# EAGLE design cellpilot (EAGLE 7.2.0)
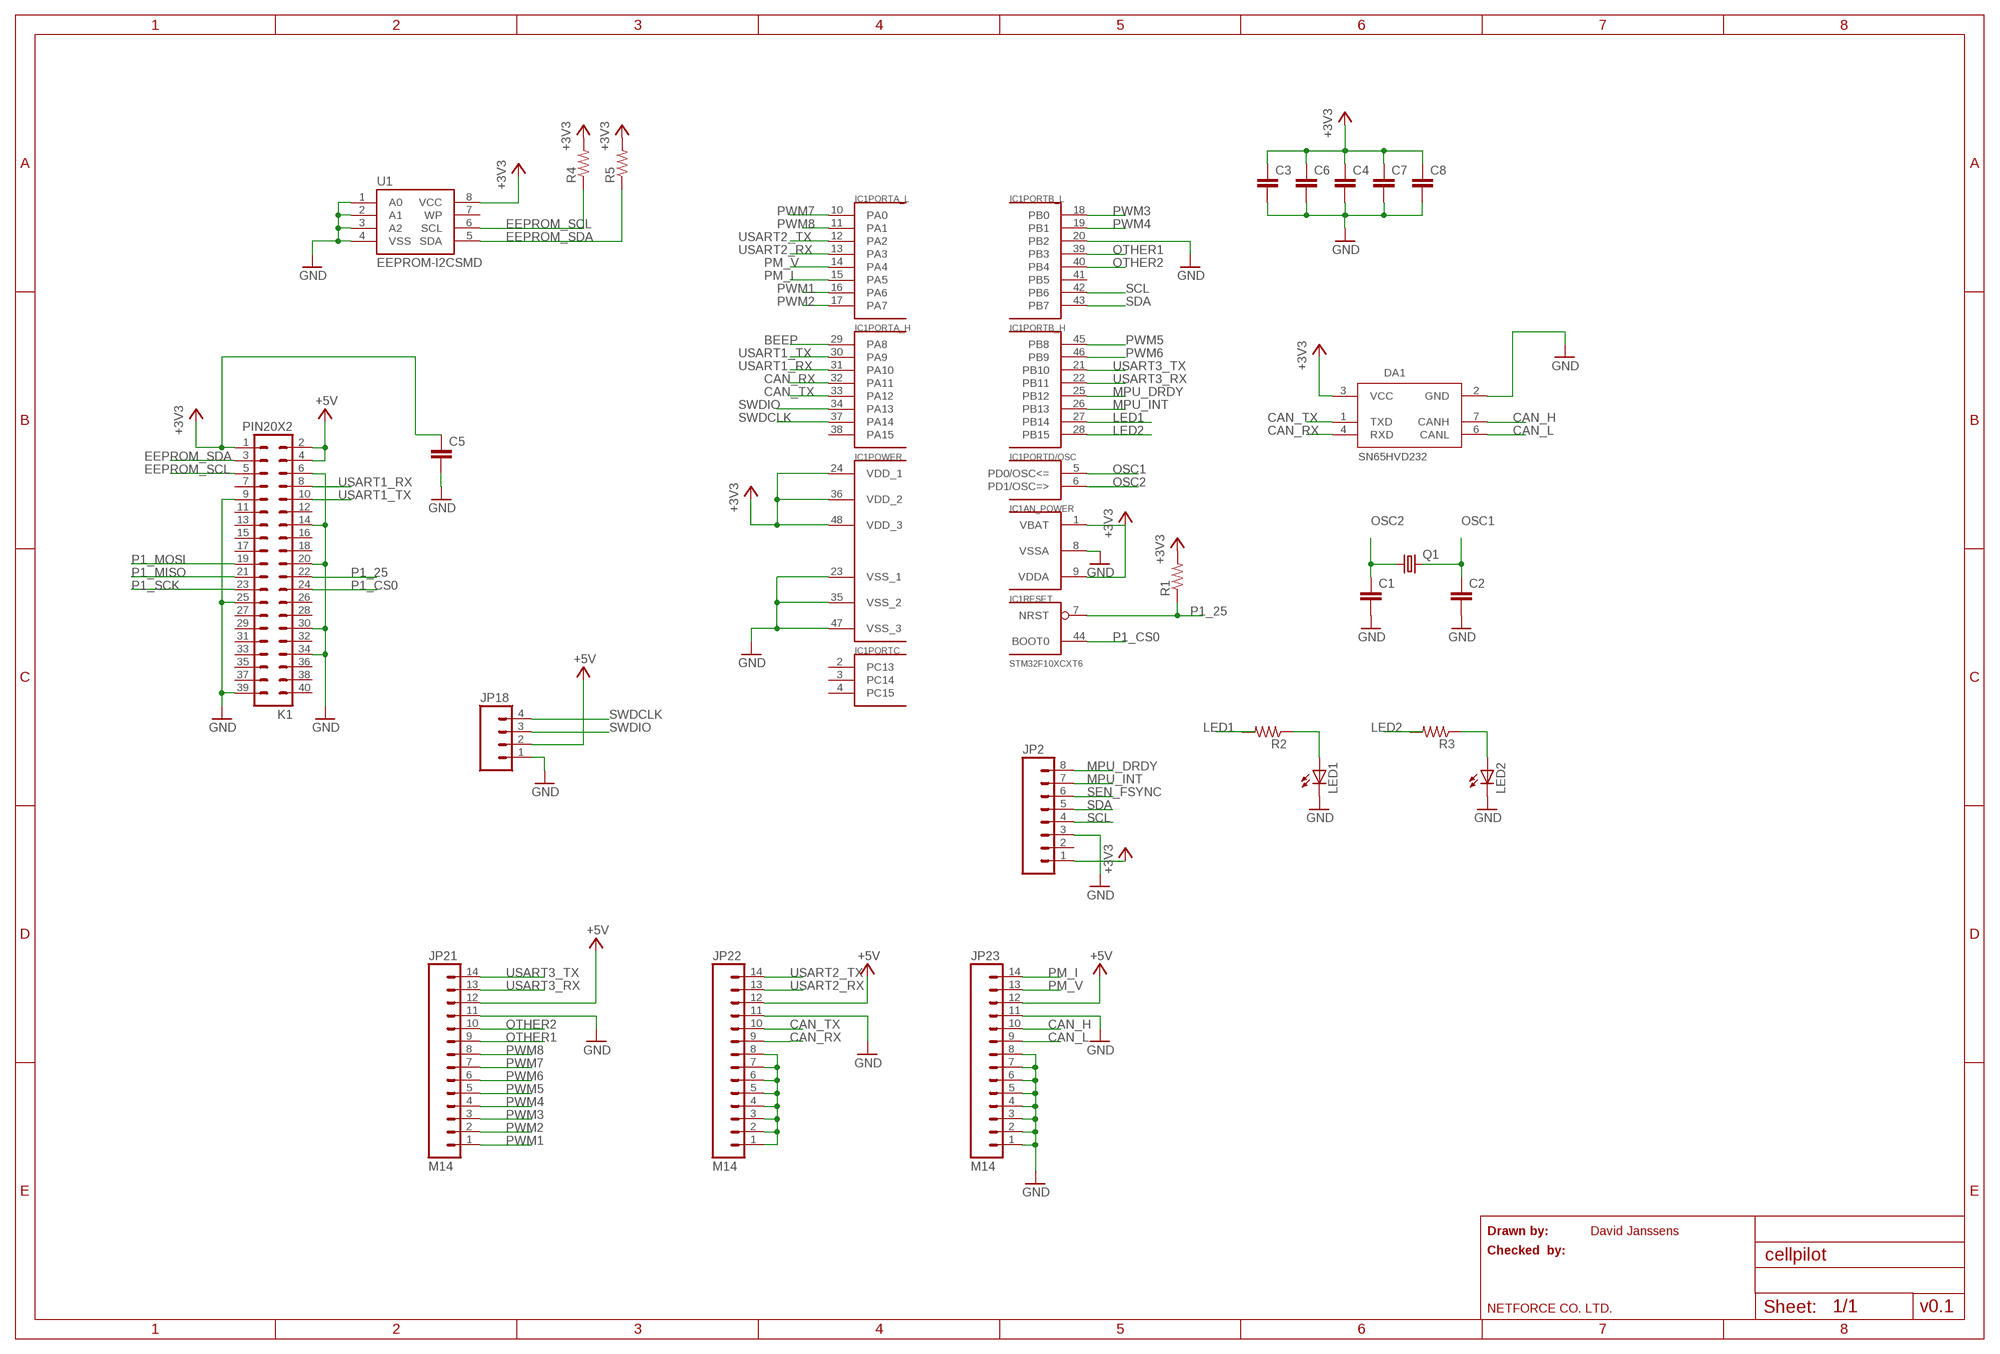
[diagram p0: schematic, sheet 1]

## Parts
C1  CAP0805  [0805]
C2  CAP0805  [0805]
C3  CAP0805  [0805]
C4  CAP0805  [0805]
C5  CAP0805  [0805]
C6  CAP0805  [0805]
C7  CAP0805  [0805]
C8  CAP0805  [0805]
DA1  SN65HVD232  [SO08]
IC1  STM32F10XCXT6  [TQFP48]
JP2  M08  [1X08_ROUND]
JP18  M04PTH  [1X04]
JP21  M14  [1X14]
JP22  M14  [1X14]
JP23  M14  [1X14]
K1  PIN20X2  [PIN_20X2]
LED1  LED3MM  [LED3MM]
LED2  LED3MM  [LED3MM]
Q1  CRYSTALHC49S  [HC49/S]
R1  RESISTOR0805-RES  [0805]
R2  RESISTOR0805-RES  [0805]
R3  RESISTOR0805-RES  [0805]
R4  RESISTOR0805-RES  [0805]
R5  RESISTOR0805-RES  [0805]
U1  EEPROM-I2CSMD  [SO08]

## Nets
+3V3: C3.1 C4.1 C5.1 C6.1 C7.1 C8.1 DA1.3(VCC) IC1.1(AN_POWER:VBAT) IC1.9(AN_POWER:VDDA) IC1.24(POWER:VDD_1) IC1.36(POWER:VDD_2) IC1.48(POWER:VDD_3) JP2.1 K1.1 R1.2 R4.2 R5.2 U1.8(VCC)
+5V: JP18.2 JP21.12 JP22.12 JP23.12 K1.2 K1.4
BEEP: IC1.29(PORTA_H:PA8)
CAN_H: DA1.7(CANH) JP23.10
CAN_L: DA1.6(CANL) JP23.9
CAN_RX: DA1.4(RXD) IC1.32(PORTA_H:PA11) JP22.9
CAN_TX: DA1.1(TXD) IC1.33(PORTA_H:PA12) JP22.10
EEPROM_SCL: K1.5 R4.1 U1.6(SCL)
EEPROM_SDA: K1.3 R5.1 U1.5(SDA)
GND: C1.2 C2.2 C3.2 C4.2 C5.2 C6.2 C7.2 C8.2 DA1.2(GND) IC1.8(AN_POWER:VSSA) IC1.20(PORTB_L:PB2) IC1.23(POWER:VSS_1) IC1.35(POWER:VSS_2) IC1.47(POWER:VSS_3) JP2.3 JP18.1 JP21.11 JP22.11 JP23.1 JP23.2 JP23.3 JP23.4 JP23.5 JP23.6 JP23.7 JP23.8 JP23.11 K1.6 K1.9 K1.14 K1.20 K1.25 K1.30 K1.34 K1.39 LED1.K(C) LED2.K(C) U1.1(A0) U1.2(A1) U1.3(A2) U1.4(VSS)
LED1: IC1.27(PORTB_H:PB14) R2.2
LED2: IC1.28(PORTB_H:PB15) R3.2
MPU_DRDY: IC1.25(PORTB_H:PB12) JP2.8
MPU_INT: IC1.26(PORTB_H:PB13) JP2.7
N$1: LED1.A R2.1
N$3: JP22.1 JP22.2 JP22.3 JP22.4 JP22.5 JP22.6 JP22.7 JP22.8
N$5: LED2.A R3.1
OSC1: C2.1 IC1.5(PORTD/OSC:PD0/OSC<=) Q1.2
OSC2: C1.1 IC1.6(PORTD/OSC:PD1/OSC=>) Q1.1
OTHER1: IC1.39(PORTB_L:PB3) JP21.9
OTHER2: IC1.40(PORTB_L:PB4) JP21.10
P1_25: IC1.7(RESET:NRST) K1.22 R1.1
P1_CS0: IC1.44(RESET:BOOT0) K1.24
P1_MISO: K1.21
P1_MOSI: K1.19
P1_SCK: K1.23
PM_I: IC1.15(PORTA_L:PA5) JP23.14
PM_V: IC1.14(PORTA_L:PA4) JP23.13
PWM1: IC1.16(PORTA_L:PA6) JP21.1
PWM2: IC1.17(PORTA_L:PA7) JP21.2
PWM3: IC1.18(PORTB_L:PB0) JP21.3
PWM4: IC1.19(PORTB_L:PB1) JP21.4
PWM5: IC1.45(PORTB_H:PB8) JP21.5
PWM6: IC1.46(PORTB_H:PB9) JP21.6
PWM7: IC1.10(PORTA_L:PA0) JP21.7
PWM8: IC1.11(PORTA_L:PA1) JP21.8
SCL: IC1.42(PORTB_L:PB6) JP2.4
SDA: IC1.43(PORTB_L:PB7) JP2.5
SEN_FSYNC: JP2.6
SWDCLK: IC1.37(PORTA_H:PA14) JP18.4
SWDIO: IC1.34(PORTA_H:PA13) JP18.3
USART1_RX: IC1.31(PORTA_H:PA10) K1.8
USART1_TX: IC1.30(PORTA_H:PA9) K1.10
USART2_RX: IC1.13(PORTA_L:PA3) JP22.13
USART2_TX: IC1.12(PORTA_L:PA2) JP22.14
USART3_RX: IC1.22(PORTB_H:PB11) JP21.13
USART3_TX: IC1.21(PORTB_H:PB10) JP21.14
Unconnected: IC1.2(PORTC:PC13) IC1.3(PORTC:PC14) IC1.4(PORTC:PC15) IC1.38(PORTA_H:PA15) IC1.41(PORTB_L:PB5) JP2.2 K1.7 K1.11 K1.12 K1.13 K1.15 K1.16 K1.17 K1.18 K1.26 K1.27 K1.28 K1.29 K1.31 K1.32 K1.33 K1.35 K1.36 K1.37 K1.38 K1.40 U1.7(WP)

## Notes on the sheet
- Drawn by: | David Janssens
- Checked  by:
- NETFORCE CO. LTD. | v0.1

## Library data of the parts
C1-C8 = SparkFun-Passives:CAP: Capacitor Standard 0603 ceramic capacitor, and 0.1" leaded capacitor.
DA1 = transceiver:SN65HVD232: CAN TRANSCEIVER
IC1 = stm32:STM32F10XCXT6: ST STM32F101/103 48pin LQFP
JP2 = SparkFun-Connectors:M08: Header 8 Standard 8-pin 0.1" header. Use with straight break away headers (SKU : PRT-00116), right angle break away headers (PRT-00553), swiss pins (PRT-00743), machine pins (PRT-00117), and female headers (PRT-00115).
JP18 = SparkFun-Connectors:M04: Header 4 Standard 4-pin 0.1" header. Use with straight break away headers (SKU : PRT-00116), right angle break away headers (PRT-00553), swiss pins (PRT-00743), machine pins (PRT-00117), and female headers (PRT-00115). Molex polarized connector foot print use with SKU : PRT-08231 with associated crimp pins and housings. 1MM SMD Version SKU: PRT-10208
JP21-JP23 = SparkFun-Connectors:M14: Header 14 Standard 14-pin 0.1" header. Use with straight break away headers (SKU : PRT-00116), right angle break away headers (PRT-00553), swiss pins (PRT-00743), machine pins (PRT-00117), and female headers (PRT-00115).
K1 = FLYFISH:PIN20X2
LED1 LED2 = adafruit:LED: LED OSRAM: - CHIPLED LG R971, LG N971, LY N971, LG Q971, LY Q971, LO R971, LY R971 LH N974, LH R974 LS Q976, LO Q976, LY Q976 LO Q996 - Hyper CHIPLED LW Q18S LB Q993, LB Q99A, LB R99A - SideLED LS A670, LO A670, LY A670, LG A670, LP A670 LB A673, LV A673, LT A673, LW A673 LH A674 LY A675 LS A676, LA A676, LO A676, LY A676, LW A676 LS A679, LY A679, LG A679 - Hyper Micro SIDELED® LS Y876, LA Y876, LO Y876, LY Y876 LT Y87S - SmartLED LW L88C, LW L88S LB L89C, LB L89S, LG L890 LS L89K, LO L89K, LY L89K LS L896, LA L896, LO L896, LY L896 - TOPLED LS T670, LO T670, LY T670, LG T670, LP T670 LSG T670, LSP T670, LSY T670, LOP T670, LYG T670 LG T671, LOG T671, LSG T671 LB T673, LV T673, LT T673, LW T673 LH T674 LS T676, LA T676, LO T676, LY T676, LB T676, LH T676, LSB T676, LW T676 LB T67C, LV T67C, LT T67C, LS T67K, LO T67K, LY T67K, LW E67C LS E67B, LA E67B, LO E67B, LY E67B, LB E67C, LV E67C, LT E67C LW T67C LS T679, LY T679, LG T679 LS T770, LO T770, LY T770, LG T770, LP T770 LB T773, LV T773, LT T773, LW T773 LH T774 LS E675, LA E675, LY E675, LS T675 LS T776, LA T776, LO T776, LY T776, LB T776 LHGB T686 LT T68C, LB T68C - Hyper Mini TOPLED® LB M676 - Mini TOPLED Santana® LG M470 LS M47K, LO M47K, LY M47K Source: http://www.osram.convergy.de/
Q1 = adafruit:CRYSTAL: CRYSTAL; OC_FARNELL: 1667008; OC_NEWARK: unknown
R1-R5 = SparkFun-Passives:RESISTOR: Resistor Basic schematic elements and footprints for 0603, 1206, and PTH resistors.
U1 = SparkFun-DigitalIC:EEPROM-I2C: I2C EEPROM chips, 24LC256 (and others)

## Board
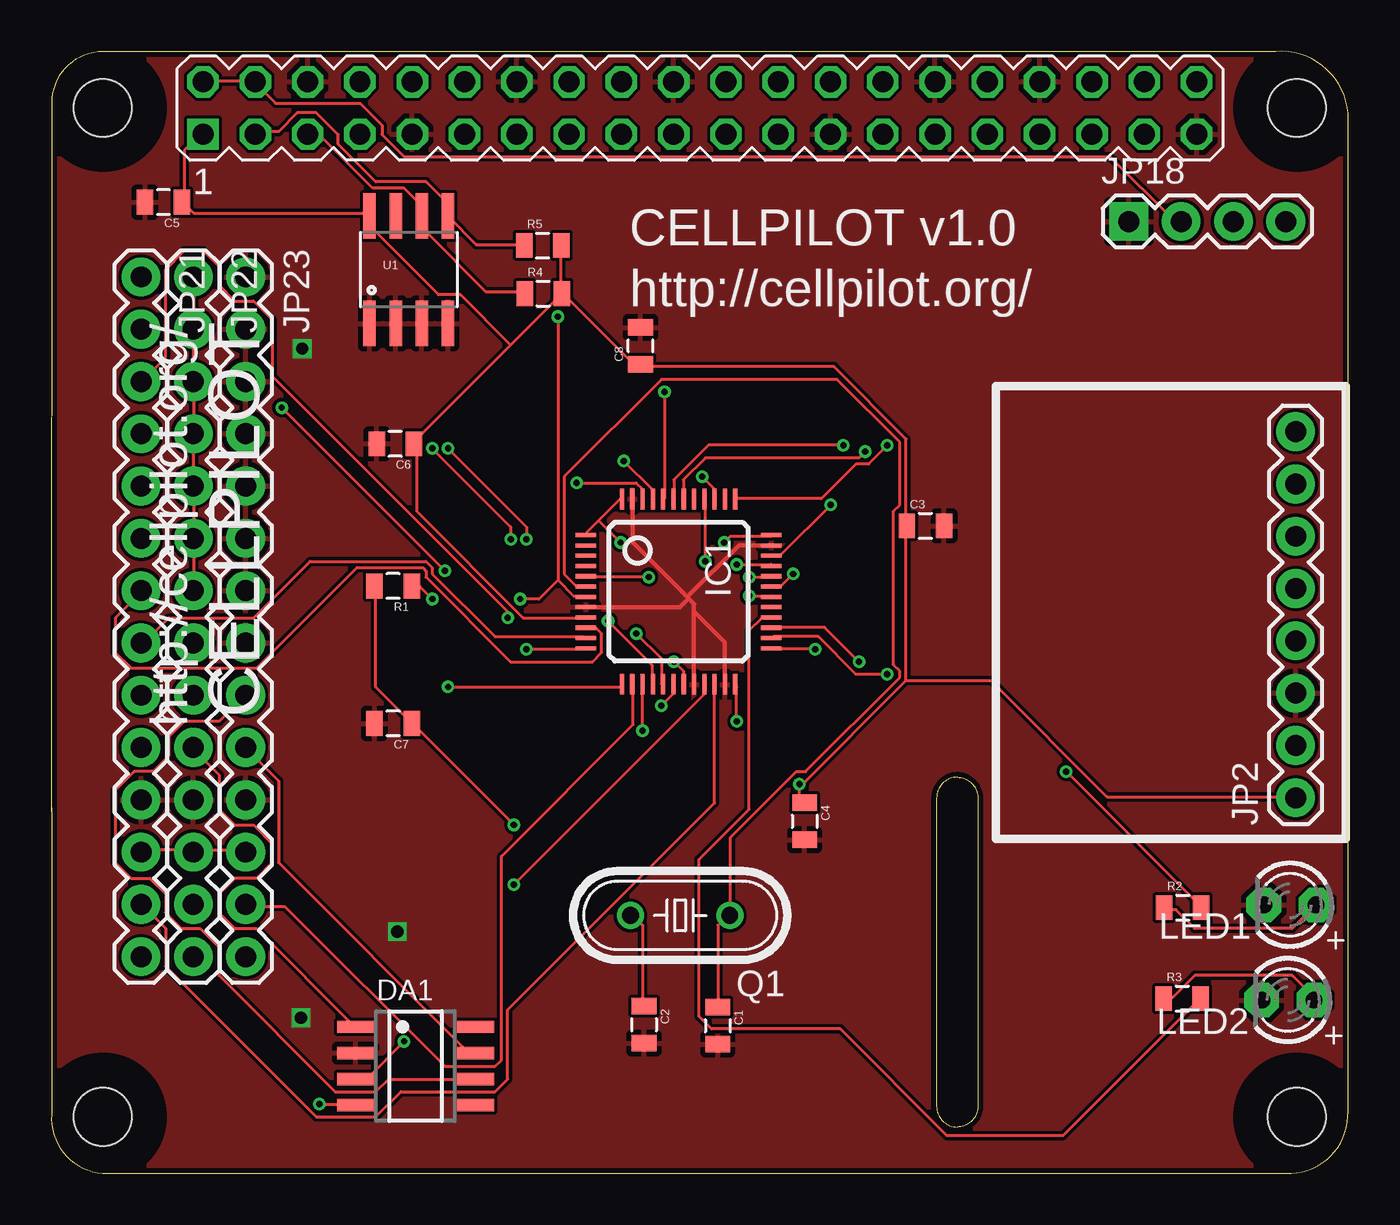
[diagram p1: board, top side]
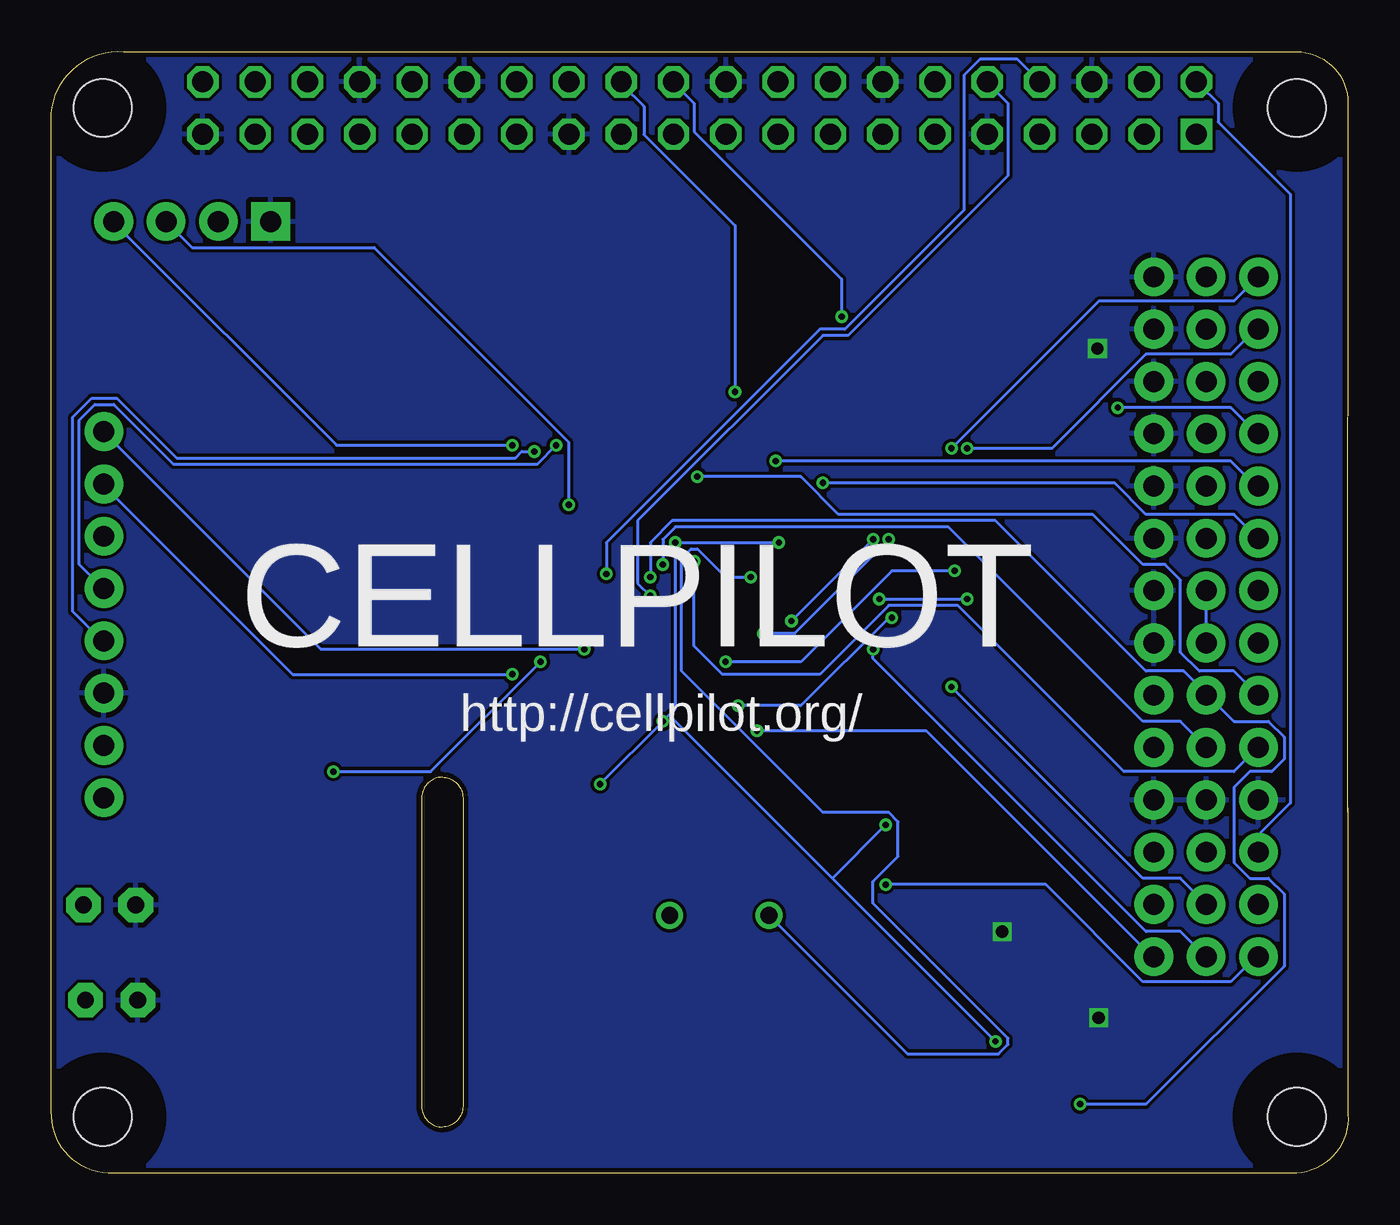
[diagram p2: board, bottom side, seen from below]

Size 62.97 x 54.49 mm. Coordinates in mm from the lower left corner, seen from the top.
Outline: 0.01,51.98 arc-90 2.5,54.48 59.47,54.48 arc-90 62.97,51.48 62.97,3 arc-90 60.23,0 2.5,0 arc-90 0.01,2.87 0.01,17.55
Outline: 0.01,17.74 0.01,17.55
Outline: 0.01,52.03 0.01,36.78
Outline: 0.01,17.55 0.01,36.73
Outline: 42.99,18.24 42.99,3.24 arc90 43.99,2.24 arc90 44.99,3.24 44.99,18.24 arc90 43.99,19.24 arc90 42.99,18.24
Copper layers (1*16): Top 0.035mm / dielectric 1.5mm / Bottom 0.035mm
Design rules "ITEADstudio_DRC": minimum track width 6mil, minimum drill 12mil, track to track 6mil, track to pad 6mil, pad to pad 6mil, via to via 6mil, smd to smd 0mil, copper to edge 10mil, drill to drill 10mil, minimum pad ring 10mil, minimum via ring 6mil, stop-mask expansion 2mil, vias tented up to drill 100mil, thermal gap 10mil
Holes 2.8 mm at 2.49,2.74 2.49,51.74 60.49,51.74 60.49,2.74
tRestrict: area 0.9,50.2 to 4,53.3; area 58.9,50.2 to 62,53.3; area 58.9,1.2 to 62,4.3; area 0.9,1.2 to 4,4.3
bRestrict: area 0.9,1.2 to 4,4.3; area 0.9,50.2 to 4,53.3; area 58.9,1.2 to 62,4.3; area 58.9,50.2 to 62,53.3
Milling: 6 lines

### Footprints (pad centres in the part's own frame; a part is rotated, then mirrored left to right if it is on the bottom)
0805 = smd 0.8 x 1.2: 1 -0.9,0; 2 0.9,0
SO08 = smd 0.6 x 1.8: 1 -1.905,-2.917; 2 -0.635,-2.917; 3 0.635,-2.917; 4 1.905,-2.917; 5 1.905,2.917; 6 0.635,2.917; 7 -0.635,2.917; 8 -1.905,2.917
TQFP48 = smd 0.2 x 1: 1 -2.75,-4.5; 2 -2.25,-4.5; 3 -1.75,-4.5; 4 -1.25,-4.5; 5 -0.75,-4.5; 6 -0.25,-4.5; 7 0.25,-4.5; 8 0.75,-4.5; 9 1.25,-4.5; 10 1.75,-4.5; 11 2.25,-4.5; 12 2.75,-4.5; 25 2.75,4.5; 26 2.25,4.5; 27 1.75,4.5; 28 1.25,4.5; 29 0.75,4.5; 30 0.25,4.5; 31 -0.25,4.5; 32 -0.75,4.5; 33 -1.25,4.5; 34 -1.75,4.5; 35 -2.25,4.5; 36 -2.75,4.5 | smd 1 x 0.2: 13 4.5,-2.75; 14 4.5,-2.25; 15 4.5,-1.75; 16 4.5,-1.25; 17 4.5,-0.75; 18 4.5,-0.25; 19 4.5,0.25; 20 4.5,0.75; 21 4.5,1.25; 22 4.5,1.75; 23 4.5,2.25; 24 4.5,2.75; 37 -4.5,2.75; 38 -4.5,2.25; 39 -4.5,1.75; 40 -4.5,1.25; 41 -4.5,0.75; 42 -4.5,0.25; 43 -4.5,-0.25; 44 -4.5,-0.75; 45 -4.5,-1.25; 46 -4.5,-1.75; 47 -4.5,-2.25; 48 -4.5,-2.75
1X08_ROUND = drill 1.016 pad 1.88: 1 0,0; 2 2.54,0; 3 5.08,0; 4 7.62,0; 5 10.16,0; 6 12.7,0; 7 15.24,0; 8 17.78,0
1X04 = drill 1.016 pad 1.88 square: 1 0,0 | drill 1.016 pad 1.88: 2 2.54,0; 3 5.08,0; 4 7.62,0
1X14 = drill 1.016 pad 1.88: 1 0,0; 2 2.54,0; 3 5.08,0; 4 7.62,0; 5 10.16,0; 6 12.7,0; 7 15.24,0; 8 17.78,0; 9 20.32,0; 10 22.86,0; 11 25.4,0; 12 27.94,0; 13 30.48,0; 14 33.02,0
PIN_20X2 = drill 1.016 square: 1 -24.13,-1.27 | drill 1.016 octagon: 2 -24.13,1.27; 3 -21.59,-1.27; 4 -21.59,1.27; 5 -19.05,-1.27; 6 -19.05,1.27; 7 -16.51,-1.27; 8 -16.51,1.27; 9 -13.97,-1.27; 10 -13.97,1.27; 11 -11.43,-1.27; 12 -11.43,1.27; 13 -8.89,-1.27; 14 -8.89,1.27; 15 -6.35,-1.27; 16 -6.35,1.27; 17 -3.81,-1.27; 18 -3.81,1.27; 19 -1.27,-1.27; 20 -1.27,1.27; 21 1.27,-1.27; 22 1.27,1.27; 23 3.81,-1.27; 24 3.81,1.27; 25 6.35,-1.27; 26 6.35,1.27; 27 8.89,-1.27; 28 8.89,1.27; 29 11.43,-1.27; 30 11.43,1.27; 31 13.97,-1.27; 32 13.97,1.27; 33 16.51,-1.27; 34 16.51,1.27; 35 19.05,-1.27; 36 19.05,1.27; 37 21.59,-1.27; 38 21.59,1.27; 39 24.13,-1.27; 40 24.13,1.27
LED3MM = drill 0.813 pad 1.676 octagon: A -1.27,0; K 1.27,0
HC49/S = drill 0.813: 1 -2.413,0; 2 2.413,0
SO08' = smd 0.61 x 2.21: 1 -1.905,-2.616; 2 -0.635,-2.616; 3 0.635,-2.616; 4 1.905,-2.616; 5 1.905,2.616; 6 0.635,2.616; 7 -0.635,2.616; 8 -1.905,2.616

### Placement (x,y rotation side)
C1  32.37,7.16 270 top
C2  28.78,7.21 270 top
C3  42.45,31.45 0 top
C4  36.58,17.09 270 top
C5  5.44,47.17 180 top
C6  16.69,35.43 180 top
C7  16.59,21.84 180 top
C8  28.61,40.18 90 top
DA1  17.68,5.21 270 top
IC1  30.46,28.24 270 top
JP2  60.43,18.24 90 top
JP18  52.33,46.23 0 top
JP21  4.35,43.54 270 top
JP22  6.89,43.54 270 top
JP23  9.43,43.54 270 top
K1  31.49,51.74 0 top
LED1  60.15,13.03 180 top
LED2  60.05,8.41 180 top
Q1  30.54,12.52 180 top
R1  16.59,28.52 180 top
R2  54.95,12.9 0 top
R3  54.92,8.48 0 top
R4  23.88,42.72 0 top
R5  23.86,45.06 0 top
U1  EEPROM-I2CSMD  [SO08']  17.35,43.89 0 top

### Tracks (layer width: path | path; a pad name or v marks a point on that pad's centre or on a via)
+3V3  (via drill 0.3)
  Top 0.152: K1.1 7.22,50.44 6.46,49.68 6.46,47.24 C5.1 6.46,47.09 6.92,46.63 15.45,46.63 U1.8 15.45,46.48 15.45,46.02 18.8,42.67 19.87,42.67 22.31,40.23 | R5.2 24.75,44.96 24.75,42.82 R4.2 | R4.2 24.9,42.67 28.25,39.32 28.56,39.32 C8.1 28.71,39.17 38,39.17 41.51,35.66 41.51,31.55 C3.1 41.51,31.39 41.51,23.93 | IC1.9 25.81,26.97 22.92,26.97 17.74,32.16 17.74,35.36 C6.1 17.58,35.51 22.31,40.23 | 22.31,40.23 24.75,42.67 R4.2 | R1.2 15.75,28.5 15.75,23.62 17.43,21.95 C7.1 17.58,21.79 v22.46,16.92 | 26.57,31.7 27.64,32.77 IC1.48 | 26.57,31.7 25.97,31.09 IC1.1 | v33.28,21.95 33.28,23.62 IC1.24 | 36.33,18.75 36.33,18.29 36.48,18.14 C4.1 | 36.33,18.75 v36.33,18.9 36.33,18.75 | v32.67,30.63 32.98,30.94 34.96,30.94 IC1.36 | 36.33,18.75 41.51,23.93 | v17.13,6.4 15.3,4.57 14.84,4.57 DA1.3 | v27.64,30.63 26.57,31.7 | 41.51,23.93 45.62,23.93 51.26,18.29 60.41,18.29 JP2.1
  Bottom 0.152: v36.33,18.9 v33.28,21.95 32.98,22.25 | 32.98,22.25 32.67,22.55 v32.67,30.63 v27.64,30.63 | 32.98,22.25 25.05,14.33 | 25.05,14.33 v17.13,6.4 | 25.05,14.33 v22.46,16.92
+5V
  Top 0.152: JP21.12 4.48,15.7 6.76,15.7 JP22.12 6.92,15.7 9.35,15.7 JP23.12 | K1.2 7.37,53.03 9.81,53.03 K1.4 9.96,52.88 10.88,51.97 14.99,51.97 16.06,50.9 16.06,50.44 17.13,49.38 51.42,49.38 54.46,46.33 54.77,46.33 JP18.2
  Bottom 0.152: JP21.12 4.32,15.7 4.32,16.46 2.8,17.98 2.8,47.55 6.31,51.05 6.31,51.97 7.22,52.88 K1.2
CAN_H
  Top 0.152: DA1.7 20.48,5.94 20.17,5.94 11.03,15.09 11.03,19.05 9.51,20.57 JP23.10
CAN_L
  Top 0.152: DA1.6 20.48,4.57 16.36,4.57 15.75,3.96 13.77,3.96 8.13,9.6 8.13,10.97 7.22,11.89 6.31,11.89 5.54,12.65 5.54,13.56 4.78,14.33 3.87,14.33 3.11,15.09 3.11,18.59 4.02,19.51 4.93,19.51 5.7,20.27 5.7,21.18 6.46,21.95 8.13,21.95 9.35,23.16 JP23.9
CAN_RX  (via drill 0.3)
  Top 0.152: v33.89,28.96 34.96,28.96 IC1.32 | v13.01,3.35 14.69,3.35 DA1.4
  Bottom 0.152: v33.89,28.96 33.89,30.63 32.82,31.7 17.13,31.7 9.81,24.38 7.98,24.38 6.92,23.32 JP22.9 6.76,23.16 5.54,21.95 3.87,21.95 3.11,21.18 3.11,20.12 3.71,19.51 4.78,19.51 5.54,18.75 5.54,15.09 4.78,14.33 3.87,14.33 3.11,13.56 3.11,10.06 9.81,3.35 v13.01,3.35
CAN_TX  (via drill 0.3)
  Top 0.152: v33.28,29.57 34.96,29.57 IC1.33 | DA1.1 14.69,7.16 9.96,11.89 8.9,11.89 8.13,12.65 8.13,13.56 8.9,14.33 9.96,14.33 10.73,15.09 10.73,16 9.81,16.92 8.9,16.92 8.13,17.68 8.13,19.36 6.92,20.57 JP22.10
  Bottom 0.152: v33.28,29.57 33.28,30.79 32.67,31.39 19.41,31.39 9.96,21.95 8.13,21.95 6.92,20.73 JP22.10
EEPROM_SCL
  Top 0.152: R4.1 22.92,42.82 21.09,42.82 18.04,45.87 18.04,46.48 U1.6 17.89,46.63 17.89,47.09 17.13,47.85 15.6,47.85 13.01,50.44 12.55,50.44 K1.5
EEPROM_SDA
  Top 0.152: R5.1 22.92,45.11 20.63,45.11 19.26,46.48 U1.5 19.26,46.63 19.26,47.09 18.19,48.16 15.75,48.16 13.93,49.99 13.93,50.44 12.86,51.51 11.94,51.51 11.03,50.6 9.96,50.6 K1.3
GND  (via drill 0.6)
  Top 0.203: IC1.47 28.21,30.65 30.61,28.25 30.88,27.98 | IC1.20 31.21,27.28 | 31.21,27.28 31.21,27.65 30.94,27.91 | 30.94,27.91 30.88,27.98 | IC1.8 30.52,27.5 30.94,27.91 | IC1.23 32.71,25.78 31.21,27.28 | IC1.35 33.4,30.5 30.88,27.98
  other vias: 12.12,7.54 16.8,11.73 12.17,40.06
  pour Bottom: 0.01,2.36 arc90 3.26,0 59.97,0 arc90 62.97,3.25 62.97,51.22 arc90 59.97,54.48 3.01,54.48 arc90 0.01,51.22 0.01,17.74
  pour Top: 0.01,2.49 arc90 3.26,0 59.97,0 arc90 62.97,3.25 62.97,51.22 arc90 59.97,54.48 3.01,54.48 arc90 0.01,51.73 0.01,17.74
LED1  (via drill 0.3)
  Top 0.152: v39.22,24.84 37.55,26.52 35.11,26.52 IC1.27 | v49.28,19.51 55.84,12.95 R2.2
  Bottom 0.152: v39.22,24.84 44.56,19.51 v49.28,19.51
LED2
  Top 0.152: IC1.28 34.96,26.97 34.5,26.97 33.89,26.36 33.89,17.68 31.45,15.24 31.45,7.62 32.06,7.01 38.31,7.01 43.49,1.83 49.13,1.83 55.68,8.38 R3.2
MPU_DRDY  (via drill 0.3)
  Top 0.152: v37.09,25.45 35.11,25.45 IC1.25
  Bottom 0.152: v37.09,25.45 49.89,25.45 60.41,35.97 JP2.8
MPU_INT  (via drill 0.3)
  Top 0.152: v40.6,24.23 39.07,24.23 37.24,26.06 35.11,26.06 IC1.26
  Bottom 0.152: v40.6,24.23 51.26,24.23 60.41,33.38 JP2.7
N$1
  Top 0.152: R2.1 54.16,12.8 54.62,12.8 55.53,11.89 60.26,11.89 61.32,12.95 LED1.A
N$3
  Top 0.152: 6.92,41 6.92,43.43 JP22.1 | 6.92,41 JP22.2 6.92,41 | 6.92,33.38 6.92,30.94 JP22.6 6.92,30.79 6.92,28.35 JP22.7 | 6.92,33.38 JP22.5 6.92,33.38 | 6.92,33.38 6.92,35.81 JP22.4 6.92,35.97 6.92,38.41 JP22.3 6.92,38.56 6.92,41
  Bottom 0.152: JP22.8 6.92,25.76 6.92,28.19 JP22.7
N$5
  Top 0.152: R3.1 54.16,8.53 54.46,8.53 55.53,9.6 60.26,9.6 61.32,8.53 LED2.A
OSC1  (via drill 0.3)
  Top 0.152: v29.01,28.96 25.97,28.96 IC1.5 | C2.1 28.71,8.23 28.71,12.04 28.25,12.5 Q1.2
  Bottom 0.152: v29.01,28.96 30.23,28.96 31.6,30.33 31.91,30.33 32.37,29.87 32.37,24.38 25.51,17.53 22.31,17.53 21.85,17.07 21.85,15.39 23.07,14.17 23.07,13.11 16.52,6.55 16.52,6.25 16.97,5.79 21.39,5.79 28.1,12.5 Q1.2
OSC2
  Top 0.152: IC1.6 25.81,28.5 25.51,28.5 24.9,29.11 24.9,33.83 29.62,38.56 38.16,38.56 41.21,35.51 41.21,32.46 40.9,32.16 40.9,24.69 41.21,24.38 41.21,24.08 36.63,19.51 36.18,19.51 32.98,16.31 32.98,12.65 Q1.1 32.82,12.5 32.37,12.04 32.37,8.08 C1.1
OTHER1  (via drill 0.3)
  Top 0.152: v31.6,33.83 32.21,33.22 32.21,32.77 IC1.39
  Bottom 0.152: v31.6,33.83 26.57,33.83 24.75,32 12.4,32 9.96,29.57 8.9,29.57 8.13,28.8 8.13,25.3 7.22,24.38 5.54,24.38 4.48,23.32 JP21.9
OTHER2  (via drill 0.3)
  Top 0.152: v31.76,29.72 31.76,32.61 IC1.40
  Bottom 0.152: v31.76,29.72 31.76,25.6 30.38,24.23 25.66,24.23 22.31,27.58 18.95,27.58 10.88,19.51 5.54,19.51 4.48,20.57 JP21.10
P1_25  (via drill 0.3)
  Top 0.152: 24.59,28.8 25.36,28.04 25.81,28.04 IC1.7 | v24.59,41.6 24.59,28.8 | v18.5,27.89 17.89,28.5 17.58,28.5 R1.1 | v22.76,27.89 23.68,27.89 24.59,28.8
  Bottom 0.152: v24.59,41.6 24.59,43.43 31.76,50.6 31.76,51.97 32.67,52.88 K1.22 | v22.76,27.89 v18.5,27.89
P1_CS0  (via drill 0.3)
  Top 0.152: v29.78,37.95 29.78,32.77 IC1.44
  Bottom 0.152: v29.78,37.95 29.78,46.02 34.19,50.44 34.19,51.82 35.26,52.88 K1.24
PM_I  (via drill 0.3)
  Top 0.152: v28.71,21.49 28.71,23.62 IC1.15
  Bottom 0.152: v28.71,21.49 20.48,21.49 9.51,10.52 JP23.14
PM_V
  Top 0.152: IC1.14 28.25,23.62 28.25,21.79 21.85,15.39 21.85,5.49 21.55,5.18 19.11,5.18 11.33,12.95 9.51,12.95 JP23.13
PWM1  (via drill 0.3)
  Top 0.152: v27.03,26.82 29.17,24.69 29.17,23.77 IC1.16 | v23.07,30.79 23.07,31.39 v19.26,35.2
  Bottom 0.152: v23.07,30.79 v27.03,26.82 | v19.26,35.2 12.1,42.37 5.54,42.37 4.48,43.43 JP21.1
PWM2  (via drill 0.3)
  Top 0.152: v28.4,26.21 29.62,24.99 29.62,23.77 IC1.17 | v22.31,30.79 22.31,31.39 v18.5,35.2
  Bottom 0.152: v28.4,26.21 26.88,26.21 v22.31,30.79 | v18.5,35.2 14.38,35.2 9.81,39.78 5.7,39.78 4.48,41 JP21.2
PWM3  (via drill 0.3)
  Top 0.152: v29.62,22.71 30.23,23.32 30.23,23.62 IC1.18 | v22.16,26.97 22.16,27.28 10.73,38.71 10.73,41.45 9.81,42.37 8.9,42.37 8.13,43.13 8.13,44.04 7.37,44.81 6.46,44.81 5.54,43.89 5.54,39.62 4.48,38.56 JP21.3
  Bottom 0.152: v29.62,22.71 26.57,22.71 22.31,26.97 v22.16,26.97
PWM4  (via drill 0.3)
  Top 0.152: v30.23,24.84 30.69,24.38 30.69,23.77 IC1.19 | v11.18,37.19 v19.11,29.26
  Bottom 0.152: v30.23,24.84 26.57,24.84 22.16,29.26 v19.11,29.26 | v11.18,37.19 5.7,37.19 4.48,35.97 JP21.4
PWM5  (via drill 0.3)
  Top 0.152: v27.79,34.59 29.17,33.22 29.17,32.77 IC1.45
  Bottom 0.152: v27.79,34.59 5.7,34.59 4.48,33.38 JP21.5
PWM6  (via drill 0.3)
  Top 0.152: v25.51,33.53 28.4,33.53 28.71,33.22 28.71,32.77 IC1.46
  Bottom 0.152: v25.51,33.53 11.33,33.53 9.81,32 5.54,32 4.48,30.94 JP21.6
PWM7
  Top 0.152: IC1.10 25.97,26.52 26.42,26.52 26.73,26.21 26.73,25.3 26.27,24.84 22.31,24.84 18.19,28.96 18.19,29.26 18.04,29.41 14.84,29.41 9.96,24.54 3.87,24.54 3.11,25.3 3.11,26.97 4.32,28.19 JP21.7
PWM8
  Top 0.152: IC1.11 25.81,26.06 21.55,26.06 18.5,29.11 18.5,29.41 18.19,29.72 12.55,29.72 9.81,26.97 5.7,26.97 4.48,25.76 JP21.8
SCL  (via drill 0.3)
  Top 0.152: v39.53,35.05 39.22,34.75 31.76,34.75 30.69,33.68 30.69,32.77 IC1.42
  Bottom 0.152: v39.53,35.05 40.14,35.05 40.44,34.75 56.9,34.75 59.8,37.64 61.02,37.64 61.93,36.73 61.93,27.28 60.56,25.91 JP2.4
SDA  (via drill 0.3)
  Top 0.152: v38.46,35.36 31.91,35.36 30.23,33.68 30.23,32.77 IC1.43
  Bottom 0.152: v38.46,35.36 39.38,34.44 57.05,34.44 59.95,37.34 60.86,37.34 61.63,36.58 61.63,29.57 60.56,28.5 JP2.5
SWDCLK  (via drill 0.3)
  Top 0.152: v40.6,35.36 39.68,34.44 39.07,34.44 37.4,32.77 33.28,32.77 IC1.37
  Bottom 0.152: v40.6,35.36 49.13,35.36 59.95,46.18 JP18.4
SWDIO  (via drill 0.3)
  Top 0.152: v37.85,32.46 35.41,30.02 35.11,30.02 IC1.34
  Bottom 0.152: v37.85,32.46 37.85,35.51 47.3,44.96 56.14,44.96 57.36,46.18 JP18.3
USART1_RX  (via drill 0.3)
  Top 0.152: v36.02,29.11 35.41,28.5 35.11,28.5 IC1.31
  Bottom 0.152: v36.02,29.11 36.02,30.63 25.66,41 24.44,41 18.65,46.79 18.65,53.34 17.89,54.1 16.06,54.1 14.99,53.03 K1.8
USART1_TX  (via drill 0.3)
  Top 0.152: v33.89,28.04 34.96,28.04 IC1.30
  Bottom 0.152: v33.89,28.04 34.5,28.65 34.5,31.7 25.51,40.69 24.29,40.69 16.52,48.46 16.52,51.97 17.43,52.88 K1.10
USART2_RX  (via drill 0.3)
  Top 0.152: v19.26,23.62 27.64,23.62 IC1.13
  Bottom 0.152: v19.26,23.62 9.96,14.33 8.13,14.33 6.92,13.11 JP22.13
USART2_TX  (via drill 0.3)
  Top 0.152: v23.07,25.45 25.81,25.45 IC1.12
  Bottom 0.152: v23.07,25.45 23.07,24.99 9.81,11.73 8.13,11.73 6.92,10.52 JP22.14
USART3_RX
  Top 0.152: IC1.22 32.21,23.62 32.21,17.98 22.16,7.92 22.16,4.57 21.55,3.96 16.97,3.96 15.75,2.74 12.86,2.74 5.54,10.06 5.54,11.89 4.48,12.95 JP21.13
USART3_TX  (via drill 0.3)
  Top 0.152: v22.46,14.02 31.76,23.32 31.76,23.62 IC1.21
  Bottom 0.152: v22.46,14.02 14.69,14.02 9.96,9.3 5.7,9.3 4.48,10.52 JP21.14

### Text on the board
tPlace: CELLPILOT v1.0 | http://cellpilot.org/ | http://cellpilot.org/ | CELLPILOT
bPlace: CELLPILOT | http://cellpilot.org/